# EAGLE design Schematico (EAGLE 9.6.2)
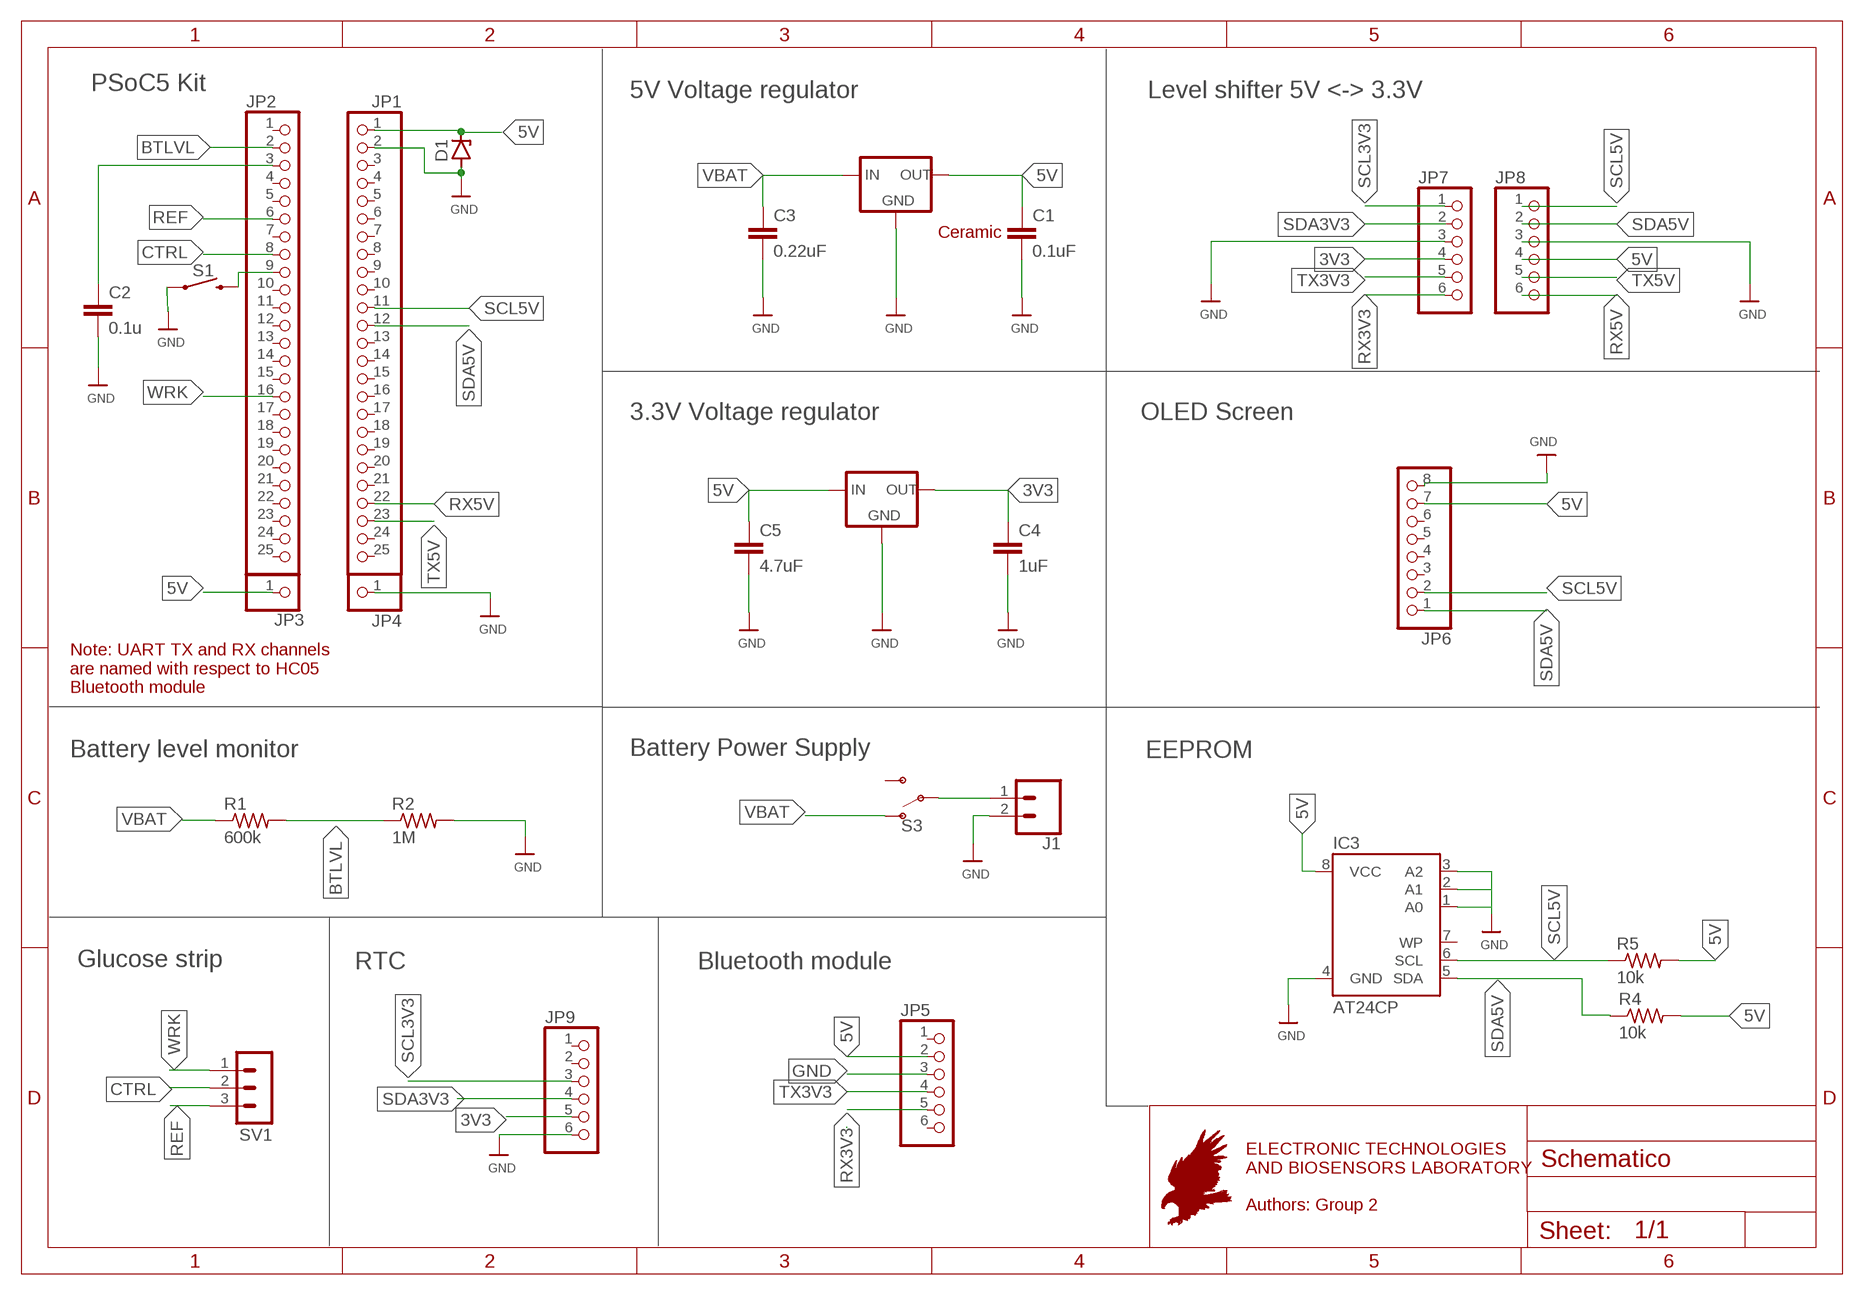
[diagram p0: schematic, sheet 1]

## Parts
C1  0.1uF  C2,5-3  [C2.5-3]
C2  0.1u  C2,5-3  [C2.5-3]
C3  0.22uF  C2,5-3  [C2.5-3]
C4  1uF  C2,5-3  [C2.5-3]
C5  4.7uF  C2,5-3  [C2.5-3]
D1  1N821  [DO35Z10]
IC1  78XXS  [78XXS]
IC2  78XXS  [78XXS]
IC3  AT24CP  [DIL08]
J1  CONN_02  [1X02]
JP1  PINHD-1X25  [1X25]
JP2  PINHD-1X25  [1X25]
JP3  PINHD-1X1  [1X01]
JP4  PINHD-1X1  [1X01]
JP5  PINHD-1X6B  [1X06-BIG]
JP6  PINHD-1X8  [1X08]
JP7  PINHD-1X6B  [1X06-BIG]
JP8  PINHD-1X6B  [1X06-BIG]
JP9  PINHD-1X6  [1X06]
R1  600k  R-US_0204/7  [0204/7]
R2  1M  R-US_0204/7  [0204/7]
R4  10k  R-US_0204/7  [0204/7]
R5  10k  R-US_0204/7  [0204/7]
S1  MOMENTARY-SWITCH-SPST-PTH-6.0MM  [TACTILE_SWITCH_PTH_6.0MM]
S3  SWITCH-SPDT-PTH-11.6X4.0MM  [SWITCH_SPDT_PTH_11.6X4.0MM]
SV1  MA03-1  [MA03-1]

## Nets
3V3: C4.1 IC1.OUT JP7.4 JP9.5
5V: C1.1 C5.1 D1.C IC1.IN IC2.OUT IC3.8(VCC) JP1.1 JP3.1 JP5.2 JP6.7 JP8.4 R4.2 R5.2
BTLVL: JP2.2 R1.2 R2.1
CTRL: JP2.8 SV1.2
GND: C1.2 C2.2 C3.2 C4.2 C5.2 D1.A IC1.GND IC2.GND IC3.1(A0) IC3.2(A1) IC3.3(A2) IC3.4(GND) J1.2 JP1.2 JP4.1 JP5.3 JP6.8 JP7.3 JP8.3 JP9.6 R2.2 S1.1
N$1: J1.1 S3.2(P)
N$2: C2.1 JP2.3
N$3: JP2.9 S1.3
REF: JP2.6 SV1.3
RX3V3: JP5.5 JP7.6
RX5V: JP1.22 JP8.6
SCL3V3: JP7.1 JP9.3
SCL5V: IC3.6(SCL) JP1.11 JP6.2 JP8.1 R5.1
SDA3V3: JP7.2 JP9.4
SDA5V: IC3.5(SDA) JP1.12 JP6.1 JP8.2 R4.1
TX3V3: JP5.4 JP7.5
TX5V: JP1.23 JP8.5
VBAT: C3.1 IC2.IN R1.1 S3.1(O)
WRK: JP2.16 SV1.1
Unconnected: IC3.7(WP) JP1.3 JP1.4 JP1.5 JP1.6 JP1.7 JP1.8 JP1.9 JP1.10 JP1.13 JP1.14 JP1.15 JP1.16 JP1.17 JP1.18 JP1.19 JP1.20 JP1.21 JP1.24 JP1.25 JP2.1 JP2.4 JP2.5 JP2.7 JP2.10 JP2.11 JP2.12 JP2.13 JP2.14 JP2.15 JP2.17 JP2.18 JP2.19 JP2.20 JP2.21 JP2.22 JP2.23 JP2.24 JP2.25 JP5.1 JP5.6 JP6.3 JP6.4 JP6.5 JP6.6 JP9.1 JP9.2 S3.3(S)

## Notes on the sheet
- PSoC5 Kit | 5V Voltage regulator | Level shifter 5V <-> 3.3V
- Ceramic
- 3.3V Voltage regulator | OLED Screen
- Note: UART TX and RX channels
  are named with respect to HC05
  Bluetooth module
- Battery level monitor | Battery Power Supply | EEPROM
- Glucose strip | RTC | Bluetooth module
- ELECTRONIC TECHNOLOGIES
  AND BIOSENSORS LABORATORY
  
  Authors: Group 2

## Library data of the parts
C1-C5 = capacitor-wima:C: CAPACITOR naming: grid - package width
D1 = diode:1N821: Reference DIODE temperature compensated, 6,2 V
IC1 IC2 = v-reg:78XXS: VOLTAGE REGULATOR
IC3 = atmel:AT24C*: 2-wire serial EEPROM; MPN: AT24C1024BW-SH-B; OC_FARNELL: 1362646; OC_NEWARK: 03P2044
J1 = SparkFun-Connectors:CONN_02: Multi connection point. Often used as Generic Header-pin footprint for 0.1 inch spaced/style header connections On any of the 0.1 inch spaced packages, you can populate with these: Break Away Headers - Straight <https://www.sparkfun.com/products/116> (PRT-00116) Break Away Male Headers - Right Angle <https://www.sparkfun.com/products/553> (PRT-00553) Female Headers <https://www.sparkfun.com/products/115> (PRT-00115) Break Away Headers - Machine Pin <https://www.sparkfun.com/products/117> (PRT-00117) Break Away Female Headers - Swiss Machine Pin <https://www.sparkfun.com/products/743> (PRT-00743) For SCREWTERMINALS and SPRING TERMINALS visit here: Screw Terimnals on SparkFun.com <https://www.sparkfun.com/search/results?term=Screw+Terminals> (5mm/3.5mm/2.54mm spacing) This device is also useful as a general connection point to wire up your design to another part of your project. Our various solder wires solder well into these plated through hole pads. Hook-Up Wire - Assortment (Stranded, 22 AWG) <https://www.sparkfun.com/products/11375> (PRT-11375) Hook-Up Wire - Assortment (Solid Core, 22 AWG) <https://www.sparkfun.com/products/11367> (PRT-11367) View the entire wire category on our website here <https://www.sparkfun.com/categories/141> Special notes: Molex polarized connector foot print use with: PRT-08233 with associated crimp pins and housings. 2.54_SCREWTERM for use with PRT-10571. 3.5mm Screw Terminal footprints for PRT-08084 5mm Screw Terminal footprints for use with PRT-08432
JP1 JP2 = pinhead:PINHD-1X25: PIN HEADER
JP3 JP4 = pinhead:PINHD-1X1: PIN HEADER
JP5 JP7 JP8 = adafruit:PINHD-1X6: PIN HEADER
JP6 = pinhead:PINHD-1X8: PIN HEADER
JP9 = pinhead:PINHD-1X6: PIN HEADER
R1 R2 R4 R5 = adafruit:R-US_: RESISTOR, American symbol
S1 = SparkFun-Switches:MOMENTARY-SWITCH-SPST: Momentary Switch (Pushbutton) - SPST Normally-open (NO) SPST momentary switches (buttons, pushbuttons). Variants PTH-12MM - 12mm square, through-hole Momentary Pushbutton Switch - 12mm Square <https://www.sparkfun.com/products/9190> (COM-09190) PTH-6.0MM, PTH-6.0MM-KIT - 6.0mm square, through-hole Mini Pushbutton Switch <https://www.sparkfun.com/products/97> (COM-00097) KIT package intended for soldering kit's - only one side of pads' copper is exposed. PTH-RIGHT-ANGLE-KIT - Right-angle, through-hole Right Angle Tactile Button <https://www.sparkfun.com/products/10791> - Used on SparkFun BigTime Watch Kit <https://www.sparkfun.com/products/11734> SMD-12MM - 12mm square, surface-mount Tactile Button - SMD (12mm) <https://www.sparkfun.com/products/12993> (COM-12993) Used on SparkFun PicoBoard <https://www.sparkfun.com/products/11888> SMD-4.5MM - 4.5mm Square Trackball Switch Used on SparkFun Blackberry Trackballer Breakout <https://www.sparkfun.com/products/13169> SMD-4.6MMX2.8MM - 4.60mm x 2.80mm, surface mount Used on SparkFun SAMD21 Mini Breakout <https://www.sparkfun.com/products/13664> SMD-5.2MM, SMD-5.2-REDUNDANT - 5.2mm square, surface-mount Mini Pushbutton Switch - SMD <https://www.sparkfun.com/products/8720> (COM-08720) Used on Arduino Pro Mini <https://www.sparkfun.com/products/11114> REDUNDANT package connects both switch circuits together SMD-6.0X3.5MM - 6.0 x 3.5mm, surface mount Momentary Reset Switch SMD <https://www.sparkfun.com/products/8229> (COM-08229) SMD-6.2MM-TALL - 6.2mm square, surface mount Tactile Button - SMD (6mm) <https://www.sparkfun.com/products/12992> Used on SparkFun Digital Sandbox <https://www.sparkfun.com/products/12651> SMD-RIGHT-ANGLE - Right-angle, surface mount Used on SparkFun Block for Intel® Edison - Arduino <https://www.sparkfun.com/products/13036>; PROD_ID: SWCH-08441; SF_SKU: COM-00097
S3 = SparkFun-Switches:SWITCH-SPDT: Single Pole, Double Throw (SPDT) Switch Single-pole, double-throw (SPDT) switch. Variant Overview SMD-AYZ0202 Surface Mount DPDT Switch <https://www.sparkfun.com/products/597> (COM-00597) Used on e.g. LilyPad Arduino USB - ATmega32U4 Board <https://www.sparkfun.com/products/12049> PTH-11.6X4.0MM SPDT Mini Power Switch <https://www.sparkfun.com/products/102> (COM-00102) Used on e.g. SparkFun Simon Says - Through-Hole Soldering Kit <https://www.sparkfun.com/products/10547> (KIT-10547) PTH-11.6X4.0MM-KIT KIT version of SPDT Mini Power Switch - Simplifies soldering by removing tStop of switch pins - only one side can be soldered. PTH-11.6X4.0MM-LOCK LOCK version of SPDT Mini Power Switch - Offset pins hold switch in place for easier soldering. SMD-RIGHT-ANGLE Surface Mount Right Angle Switch <https://www.sparkfun.com/products/10860> (COM-10860) Used on e.g. SparkFun ESP8266 Thing <https://www.sparkfun.com/products/13231>; PROD_ID: SWCH-08261; SF_SKU: COM-00102
SV1 = con-lstb:MA03-1: PIN HEADER; OC_FARNELL: unknown; OC_NEWARK: unknown

## Board
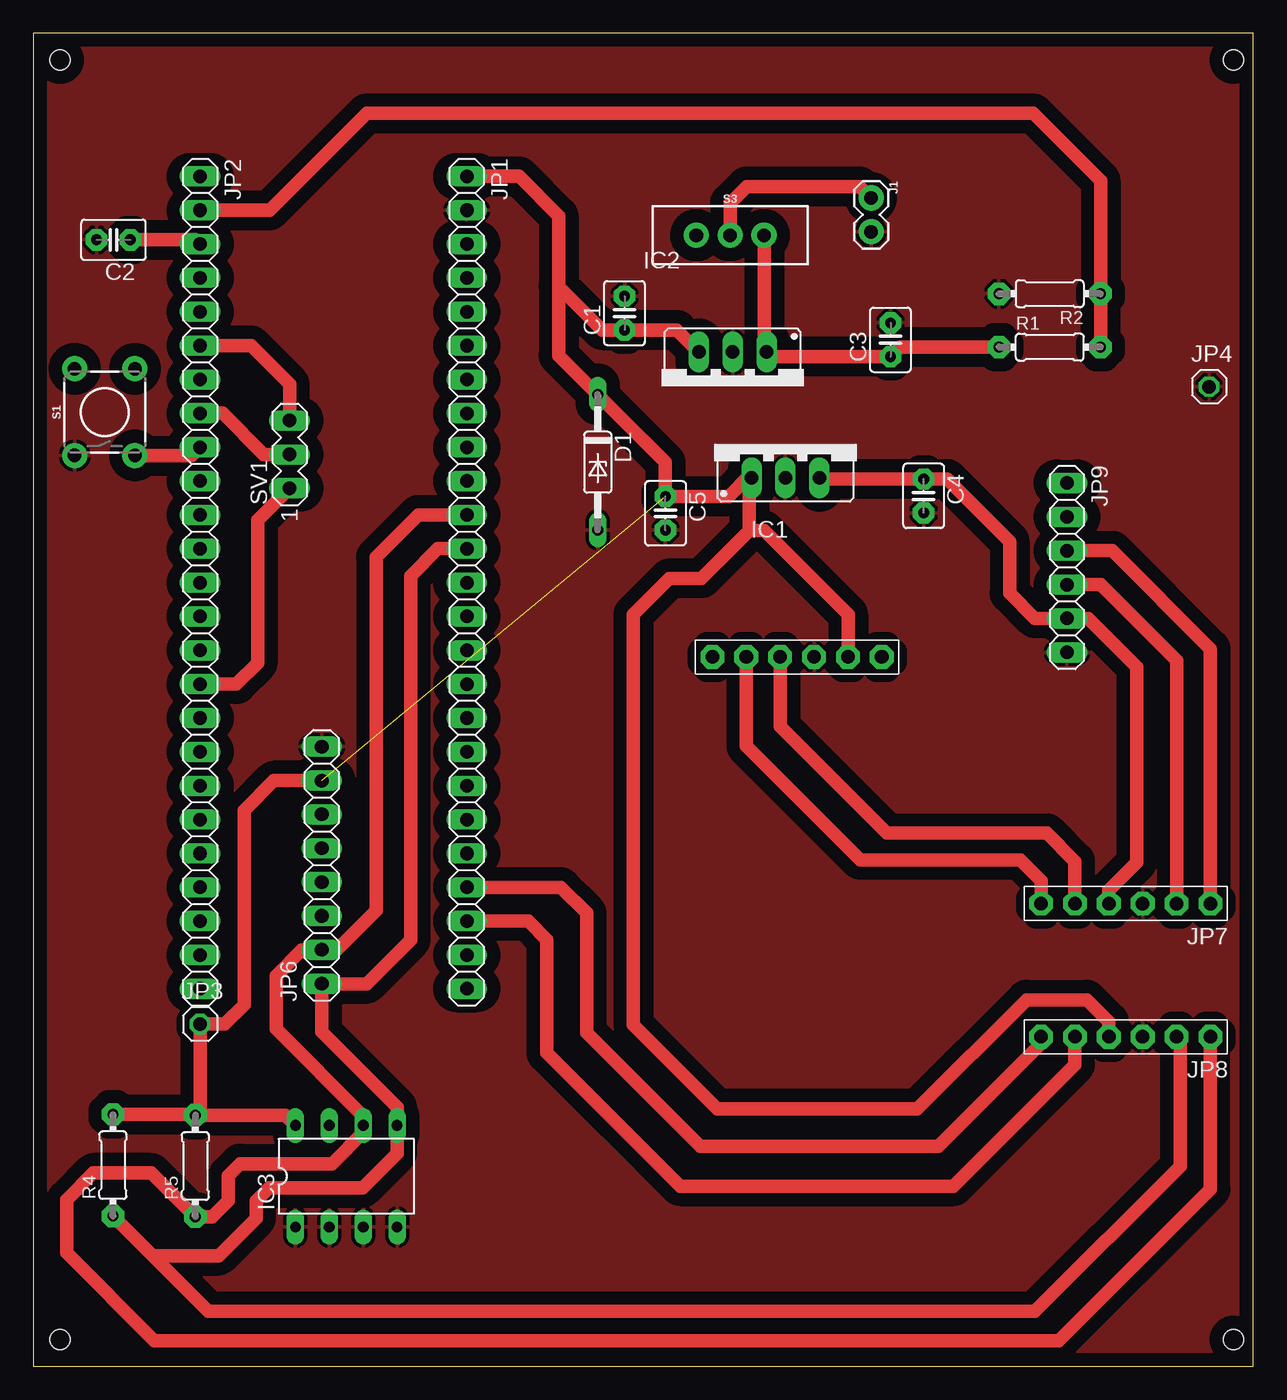
[diagram p1: board, top side]

Size 91.5 x 100 mm. Coordinates in mm from the lower left corner, seen from the top.
Outline: 0,0 91.5,0 91.5,100 0,100 0,0
Copper layers (1*16): Top 0.035mm / dielectric 1.5mm / Bottom 0.035mm
Design rules "default": minimum track width 6mil, minimum drill 0.35mm, track to track 6mil, track to pad 6mil, pad to pad 6mil, via to via 6mil, smd to smd 6mil, copper to edge 40mil, drill to drill 6mil, minimum pad ring 10mil, minimum via ring 8mil, stop-mask expansion 4mil, vias tented up to drill 0mil, thermal gap 10mil
Holes 1.5 mm at 2,98 90,98 90,2 2,2

### Footprints (pad centres in the part's own frame; a part is rotated, then mirrored left to right if it is on the bottom)
C2.5-3 = drill 0.813 pad 1.6 octagon: 1 -1.27,0; 2 1.27,0
DO35Z10 = drill 0.813 long: A 5.08,0; C -5.08,0
78XXS = drill 1.016 long: GND 0,-2.54; IN -2.54,-2.54; OUT 2.54,-2.54
DIL08 = drill 0.813 long: 1 -3.81,-3.81; 2 -1.27,-3.81; 3 1.27,-3.81; 4 3.81,-3.81; 5 3.81,3.81; 6 1.27,3.81; 7 -1.27,3.81; 8 -3.81,3.81
1X02 = drill 1.016 pad 1.88: 1 0,0; 2 2.54,0
1X25 = drill 1.016 long: 1 -29.21,0; 2 -26.67,0; 3 -24.13,0; 4 -21.59,0; 5 -19.05,0; 6 -16.51,0; 7 -13.97,0; 8 -11.43,0; 9 -8.89,0; 10 -6.35,0; 11 -3.81,0; 12 -1.27,0; 13 1.27,0; 14 3.81,0; 15 6.35,0; 16 8.89,0; 17 11.43,0; 18 13.97,0; 19 16.51,0; 20 19.05,0; 21 21.59,0; 22 24.13,0; 23 26.67,0; 24 29.21,0; 25 31.75,0
1X01 = drill 1.016 octagon: 1 0,0
1X06-BIG = drill 1.016 pad 1.778 octagon: 1 -6.35,0; 2 -3.81,0; 3 -1.27,0; 4 1.27,0; 5 3.81,0; 6 6.35,0
1X08 = drill 1.016 long: 1 -8.89,0; 2 -6.35,0; 3 -3.81,0; 4 -1.27,0; 5 1.27,0; 6 3.81,0; 7 6.35,0; 8 8.89,0
1X06 = drill 1.016 long: 1 -6.35,0; 2 -3.81,0; 3 -1.27,0; 4 1.27,0; 5 3.81,0; 6 6.35,0
0204/7 = drill 0.813 pad 1.676 octagon: 1 -3.81,0; 2 3.81,0
TACTILE_SWITCH_PTH_6.0MM = drill 1.016 pad 1.88: 1 -3.251,2.261; 2 3.251,2.261; 3 -3.251,-2.261; 4 3.251,-2.261
SWITCH_SPDT_PTH_11.6X4.0MM = drill 1.016 pad 1.88: 1 0,2.54; 2 0,0; 3 0,-2.54
MA03-1 = drill 1.016 long: 1 -2.54,0; 2 0,0; 3 2.54,0

### Placement (x,y rotation side)
C1  44.34,79.01 90 top
C2  6.01,84.51 180 top
C3  64.29,77.01 90 top
C4  66.77,65.29 270 top
C5  47.41,63.99 270 top
D1  42.33,67.82 270 top
IC1  56.41,69.18 0 top
IC2  52.45,73.55 180 top
IC3  23.47,14.25 0 top
J1  62.83,87.65 270 top
JP1  32.51,60.06 270 top
JP2  12.51,60.06 270 top
JP3  12.51,25.67 0 top
JP4  88.18,73.49 0 top
JP5  57.28,53.21 180 top
JP6  21.63,37.59 90 top
JP7  81.93,34.71 180 top
JP8  81.93,24.71 180 top
JP9  77.52,59.91 270 top
R1  76.23,76.46 0 top
R2  76.23,80.46 180 top
R4  5.97,15.08 90 top
R5  12.15,15.02 90 top
S1  5.36,71.58 90 top
S3  52.26,84.85 270 top
SV1  19.22,68.41 90 top

### Tracks (layer width: path | path; a pad name or v marks a point on that pad's centre or on a via)
3V3
  Top 1.016: IC1.OUT 59.03,66.56 C4.1 68.54,66.56 73.22,61.88 73.22,58 75.12,56.1 JP9.5 79.1,56.1 82.76,52.44 82.76,37.81 80.66,35.71 JP7.4
5V  (1 unrouted)
  Top 1.016: IC2.OUT 48.26,77.74 C1.1 42.66,77.74 39.4,81 | JP1.1 36.43,89.27 39.4,86.3 39.4,81 | 53.7,66.81 52.15,65.26 C5.1 47.41,67.82 D1.C 39.4,75.83 39.4,81 | JP8.4 80.66,25.84 79,27.5 74.5,27.5 66.3,19.3 51.3,19.3 45,25.6 45,56.4 47.7,59.1 50.1,59.1 53.7,62.7 | IC3.8 18.89,18.83 R5.2 12.09,18.89 R4.2 12.39,18.89 12.51,19.01 JP3.1 14.37,25.67 15.8,27.1 15.8,41.7 18.04,43.94 JP6.7 | 53.7,66.81 IC1.IN | 53.7,66.81 53.7,62.7 | 53.7,62.7 54.8,62.7 61.1,56.4 JP5.2
BTLVL
  Top 1.016: R1.2 R2.1 80.04,88.96 75,94 25,94 17.73,86.73 JP2.2
CTRL
  Top 1.016: JP2.8 14.21,71.49 17.29,68.41 SV1.2
GND
  pour Top (isolate 1): 0,100 0,0 91.5,0 91.5,100
N$1
  Top 1.016: J1.1 61.98,88.5 53.5,88.5 52.26,87.26 S3.2
N$2
  Top 1.016: C2.1 12.19,84.51 JP2.3
N$3
  Top 1.016: S1.3 11.89,68.33 JP2.9
REF
  Top 1.016: SV1.3 19.22,73.68 16.33,76.57 JP2.6
RX3V3
  Top 1.016: JP5.5 53.47,46.53 62,38 74,38 75.58,36.42 JP7.6
RX5V
  Top 1.016: JP8.6 75.58,24.21 67.87,16.5 50,16.5 41.5,25 41.5,34 39.57,35.93 JP1.22
SCL3V3
  Top 1.016: JP9.3 80.92,61.18 88.28,53.82 JP7.1
SCL5V
  Top 1.016: JP1.11 28.87,63.87 25.7,60.7 25.7,34.2 22.74,31.24 JP6.2 20.14,31.24 18.2,29.3 18.2,25.3 24.74,18.76 IC3.6 24.74,17.54 22.4,15.2 15.5,15.2 14.6,14.3 14.6,12.4 13.41,11.21 R5.1 8.86,14.5 4.5,14.5 2.5,12.5 2.5,8.5 9.08,1.92 76.92,1.92 88.28,13.28 JP8.1
SDA3V3
  Top 1.016: JP7.2 85.74,52.96 80.06,58.64 JP9.4
SDA5V
  Top 1.016: JP1.12 30.33,61.33 28.3,59.3 28.3,32 25,28.7 JP6.1 21.63,25.07 27.28,19.42 IC3.5 27.28,15.98 24.7,13.4 17.7,13.4 16.7,12.4 16.7,11.1 13.9,8.3 8.94,8.3 | R4.1 8.94,8.3 | 8.94,8.3 13.12,4.12 75.12,4.12 86,15 86,24.45 JP8.2
TX3V3
  Top 1.016: JP5.4 56.01,47.99 64,40 76,40 78.12,37.88 JP7.5
TX5V
  Top 1.016: JP1.23 37.11,33.39 38.5,32 38.5,23.5 48.5,13.5 69,13.5 78.12,22.62 JP8.5
VBAT
  Top 1.016: S3.1 54.8,76.28 IC2.IN 55.34,75.74 C3.1 65.01,76.46 R1.1
WRK
  Top 1.016: SV1.1 16.82,63.47 16.82,52.77 15.22,51.17 JP2.16